# EAGLE design ESP12E Brain (EAGLE 9.3.0)
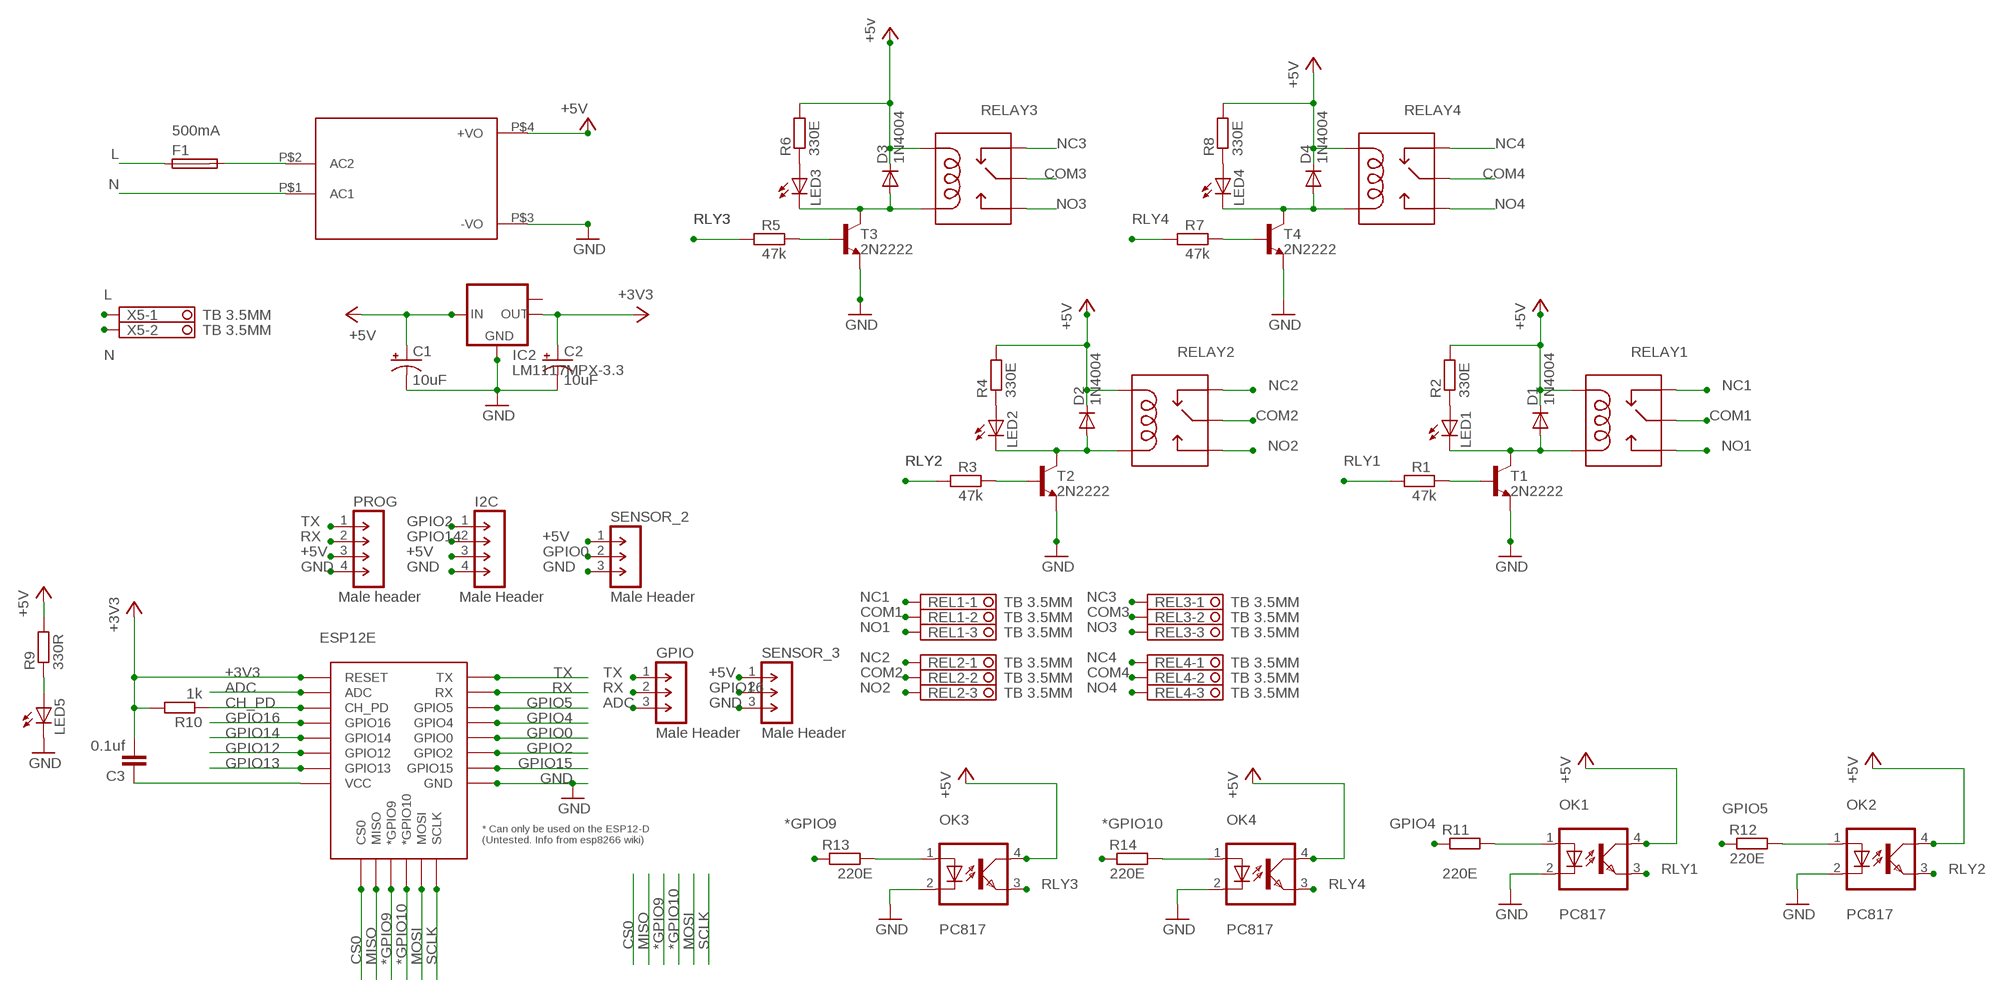
[diagram p0: schematic, sheet 1]

## Parts
C1  10uF  10UF-POLAR-RADIAL-2.5MM-25V-20%  [CPOL-RADIAL-2.5MM-5MM]
C2  10uF  10UF-POLAR-RADIAL-2.5MM-25V-20%  [CPOL-RADIAL-2.5MM-5MM]
C3  0.1uf  C-EU025-030X050  [C025-030X050]
D1  1N4004  [DO41-10]
D2  1N4004  [DO41-10]
D3  1N4004  [DO41-10]
D4  1N4004  [DO41-10]
ESP12E  ESP12ESMD  [ESP12E-SMD]
F1  500mA  FUSEBLANK_5X20MM  [FUSE_HOLDER_5X20MM]
GPIO  Male Header  M-1X03-SIP-100-32  [SIP-100-03-32]
HLK  HLK-PM013W  [HLK-PM01]
I2C  Male Header  M-1X04-SIP-100-32  [SIP-100-04-32]
IC2  LM1117MPX-3.3  [SOT223]
LED1  LEDCHIP-LED0603  [CHIP-LED0603]
LED2  LEDCHIP-LED0603  [CHIP-LED0603]
LED3  LEDCHIP-LED0603  [CHIP-LED0603]
LED4  LEDCHIP-LED0603  [CHIP-LED0603]
LED5  LEDCHIP-LED0603  [CHIP-LED0603]
OK1  PC817  [DIL04]
OK2  PC817  [DIL04]
OK3  PC817  [DIL04]
OK4  PC817  [DIL04]
PROG  Male header  M-1X04-SIP-100-32  [SIP-100-04-32]
R1  47k  R-EU_0204/7  [0204/7]
R2  330E  R-EU_0204/7  [0204/7]
R3  47k  R-EU_0204/7  [0204/7]
R4  330E  R-EU_0204/7  [0204/7]
R5  47k  R-EU_0204/7  [0204/7]
R6  330E  R-EU_0204/7  [0204/7]
R7  47k  R-EU_0204/7  [0204/7]
R8  330E  R-EU_0204/7  [0204/7]
R9  330R  R-EU_0204/7  [0204/7]
R10  1k  R-EU_0204/7  [0204/7]
R11  220E  R-EU_0204/7  [0204/7]
R12  220E  R-EU_0204/7  [0204/7]
R13  220E  R-EU_0204/7  [0204/7]
R14  220E  R-EU_0204/7  [0204/7]
REL1  TB 3.5MM  TERMINAL-BLOCK-3.5MM-3-PIN-ROUND-PAD  [TERMINAL-BLOCK-3-PIN-3.5MM-ROUND-PAD]
REL2  TB 3.5MM  TERMINAL-BLOCK-3.5MM-3-PIN-ROUND-PAD  [TERMINAL-BLOCK-3-PIN-3.5MM-ROUND-PAD]
REL3  TB 3.5MM  TERMINAL-BLOCK-3.5MM-3-PIN-ROUND-PAD  [TERMINAL-BLOCK-3-PIN-3.5MM-ROUND-PAD]
REL4  TB 3.5MM  TERMINAL-BLOCK-3.5MM-3-PIN-ROUND-PAD  [TERMINAL-BLOCK-3-PIN-3.5MM-ROUND-PAD]
RELAY1  SRD-0XVDC-SL-CSRD-05VDC-SL-C  [SRD-0XVDC-SL-C]
RELAY2  SRD-0XVDC-SL-CSRD-05VDC-SL-C  [SRD-0XVDC-SL-C]
RELAY3  SRD-0XVDC-SL-CSRD-05VDC-SL-C  [SRD-0XVDC-SL-C]
RELAY4  SRD-0XVDC-SL-CSRD-05VDC-SL-C  [SRD-0XVDC-SL-C]
SENSOR_2  Male Header  M-1X03-SIP-100-32  [SIP-100-03-32]
SENSOR_3  Male Header  M-1X03-SIP-100-32  [SIP-100-03-32]
T1  2N2222  [TO92-EBC-OVAL]
T2  2N2222  [TO92-EBC-OVAL]
T3  2N2222  [TO92-EBC-OVAL]
T4  2N2222  [TO92-EBC-OVAL]
X5  TB 3.5MM  TERMINAL-BLOCK-3.5MM-2-PIN-ROUND-PAD  [TERMINAL-BLOCK-2-PIN-3.5MM-ROUND-PAD]

## Nets
*GPIO9: ESP12E.GPIO9(*GPIO9) R13.1
*GPIO10: ESP12E.GPIO10(*GPIO10) R14.1
+3V3: C2.1(+) C3.2 ESP12E.RESET IC2.2(OUT) R10.2
+5V: C1.1(+) D1.C D2.C D3.C D4.C HLK.P$4(+VO) I2C.3 IC2.3(IN) OK1.4(COL) OK2.4(COL) OK3.4(COL) OK4.4(COL) PROG.3 R2.2 R4.2 R6.2 R8.2 R9.2 RELAY1.COIL1 RELAY2.COIL1 RELAY3.COIL1 RELAY4.COIL1 SENSOR_2.1 SENSOR_3.1 ; supply symbol labelled +5v
AC2: F1.2 HLK.P$2(AC2)
ADC: ESP12E.ADC GPIO.3
CH_PD: ESP12E.CH_PD R10.1
COM1: REL1.2 RELAY1.SWCOMMON
COM2: REL2.2 RELAY2.SWCOMMON
COM3: REL3.2 RELAY3.SWCOMMON
COM4: REL4.2 RELAY4.SWCOMMON
CS0: ESP12E.CS0
GND: C1.2(-) C2.2(-) ESP12E.GND HLK.P$3(-VO) I2C.4 IC2.1(GND) LED5.C OK1.2(C) OK2.2(C) OK3.2(C) OK4.2(C) PROG.4 SENSOR_2.3 SENSOR_3.3 T1.E T2.E T3.E T4.E
GPIO0: ESP12E.GPIO0 SENSOR_2.2
GPIO2: ESP12E.GPIO2 I2C.1
GPIO4: ESP12E.GPIO4 R11.1
GPIO5: ESP12E.GPIO5 R12.1
GPIO12: ESP12E.GPIO12
GPIO13: ESP12E.GPIO13
GPIO14: ESP12E.GPIO14 I2C.2
GPIO15: ESP12E.GPIO15
GPIO16: ESP12E.GPIO16 SENSOR_3.2
L: F1.1 X5.1
MISO: ESP12E.MISO
MOSI: ESP12E.MOSI
N: HLK.P$1(AC1) X5.2
N$1: R1.2 T1.B
N$2: D1.A LED1.C RELAY1.COIL0 T1.C
N$3: OK1.1(A) R11.2
N$4: D2.A LED2.C RELAY2.COIL0 T2.C
N$6: LED1.A R2.1
N$7: R3.2 T2.B
N$8: LED2.A R4.1
N$9: D3.A LED3.C RELAY3.COIL0 T3.C
N$10: OK2.1(A) R12.2
N$11: R5.2 T3.B
N$12: LED3.A R6.1
N$13: D4.A LED4.C RELAY4.COIL0 T4.C
N$14: OK3.1(A) R13.2
N$15: R7.2 T4.B
N$16: LED4.A R8.1
N$17: C3.1 ESP12E.VCC
N$19: LED5.A R9.1
N$35: OK4.1(A) R14.2
NC1: REL1.1 RELAY1.SWCLOSED(SWCLOSE)
NC2: REL2.1 RELAY2.SWCLOSED(SWCLOSE)
NC3: REL3.1 RELAY3.SWCLOSED(SWCLOSE)
NC4: REL4.1 RELAY4.SWCLOSED(SWCLOSE)
NO1: REL1.3 RELAY1.SWOPEN
NO2: REL2.3 RELAY2.SWOPEN
NO3: REL3.3 RELAY3.SWOPEN
NO4: REL4.3 RELAY4.SWOPEN
RLY1: OK1.3(EMIT) R1.1
RLY2: OK2.3(EMIT) R3.1
RLY3: OK3.3(EMIT) R5.1
RLY4: OK4.3(EMIT) R7.1
RX: ESP12E.RXD0(RX) GPIO.2 PROG.2
SCLK: ESP12E.SCLK
TX: ESP12E.TXD0(TX) GPIO.1 PROG.1
Unconnected: IC2.TAB(OUT1)

## Library data of the parts
C1 C2 = SparkFun-Capacitors:10UF-POLAR: 10.0µF polarized capacitors A capacitor is a passive two-terminal electrical component used to store electrical energy temporarily in an electric field.; PROD_ID: CAP-08440
C3 = rcl:C-EU: CAPACITOR, European symbol; SPICEPREFIX: C
D1-D4 = adafruit:1N4004: DIODE General purpose 1N400x type rectifier (With bigger pads) http://www.ladyada.net/library/pcb/eaglelibrary.html
ESP12E = esp8266modules:ESP12E: ESP12E Module
F1 = fuse:FUSE: Fuse; OC_FARNELL: unknown; OC_NEWARK: unknown
GPIO SENSOR_2 SENSOR_3 = con-headers-jp:M-1X03-: MALE HEADER
HLK = HLK-PM01:HLK-PM01: Hi-Link Power Supply HLK-PM01 3W Author: Ahmed Said <https://github.com/AhmedSaid/EAGLELibraries>
I2C PROG = con-headers-jp:M-1X04-: MALE HEADER
IC2 = lm1117:LM1117MPX-*
LED1-LED5 = adafruit:LED: LED OSRAM: - CHIPLED LG R971, LG N971, LY N971, LG Q971, LY Q971, LO R971, LY R971 LH N974, LH R974 LS Q976, LO Q976, LY Q976 LO Q996 - Hyper CHIPLED LW Q18S LB Q993, LB Q99A, LB R99A - SideLED LS A670, LO A670, LY A670, LG A670, LP A670 LB A673, LV A673, LT A673, LW A673 LH A674 LY A675 LS A676, LA A676, LO A676, LY A676, LW A676 LS A679, LY A679, LG A679 - Hyper Micro SIDELED® LS Y876, LA Y876, LO Y876, LY Y876 LT Y87S - SmartLED LW L88C, LW L88S LB L89C, LB L89S, LG L890 LS L89K, LO L89K, LY L89K LS L896, LA L896, LO L896, LY L896 - TOPLED LS T670, LO T670, LY T670, LG T670, LP T670 LSG T670, LSP T670, LSY T670, LOP T670, LYG T670 LG T671, LOG T671, LSG T671 LB T673, LV T673, LT T673, LW T673 LH T674 LS T676, LA T676, LO T676, LY T676, LB T676, LH T676, LSB T676, LW T676 LB T67C, LV T67C, LT T67C, LS T67K, LO T67K, LY T67K, LW E67C LS E67B, LA E67B, LO E67B, LY E67B, LB E67C, LV E67C, LT E67C LW T67C LS T679, LY T679, LG T679 LS T770, LO T770, LY T770, LG T770, LP T770 LB T773, LV T773, LT T773, LW T773 LH T774 LS E675, LA E675, LY E675, LS T675 LS T776, LA T776, LO T776, LY T776, LB T776 LHGB T686 LT T68C, LB T68C - Hyper Mini TOPLED® LB M676 - Mini TOPLED Santana® LG M470 LS M47K, LO M47K, LY M47K Source: http://www.osram.convergy.de/
OK1-OK4 = optocoupler:PC817: SHARP OPTO COUPLER
R1 R3 R5 R7 = rcl:R-EU_: RESISTOR, European symbol; R1: 4.7k; SPICEPREFIX: 4.7k
R2 R4 R6 R8-R14 = rcl:R-EU_: RESISTOR, European symbol; SPICEPREFIX: R
REL1-REL4 = Rembrandt Electronics - Terminal Block 3-5mm v1-0:TERMINAL-BLOCK-3.5MM-3-PIN: Terminal Block 3.5mm Pitch: 3,5 mm Number of pins: 3 Created by Rembrandt Electronics www.rembrandtelectronics.com
RELAY1-RELAY4 = SRD-0XVDC-SL-C:SRD-0XVDC-SL-C: SRD-05VDC-SL-C SRD-06VDC-SL-C Compatible with: SONGLE Relays SHUN YU JQX-3F other same relays Author: Ahmed Said <https://github.com/AhmedSaid/EAGLELibraries>
T1-T4 = adafruit:2N2222: NPN TRANSISTOR Big oval pads
X5 = Rembrandt Electronics - Terminal Block 3-5mm v1-0:TERMINAL-BLOCK-3.5MM-2-PIN: Terminal Block 3.5mm Pitch: 3,5 mm Number of pins: 2 Created by Rembrandt Electronics www.rembrandtelectronics.com

## Board
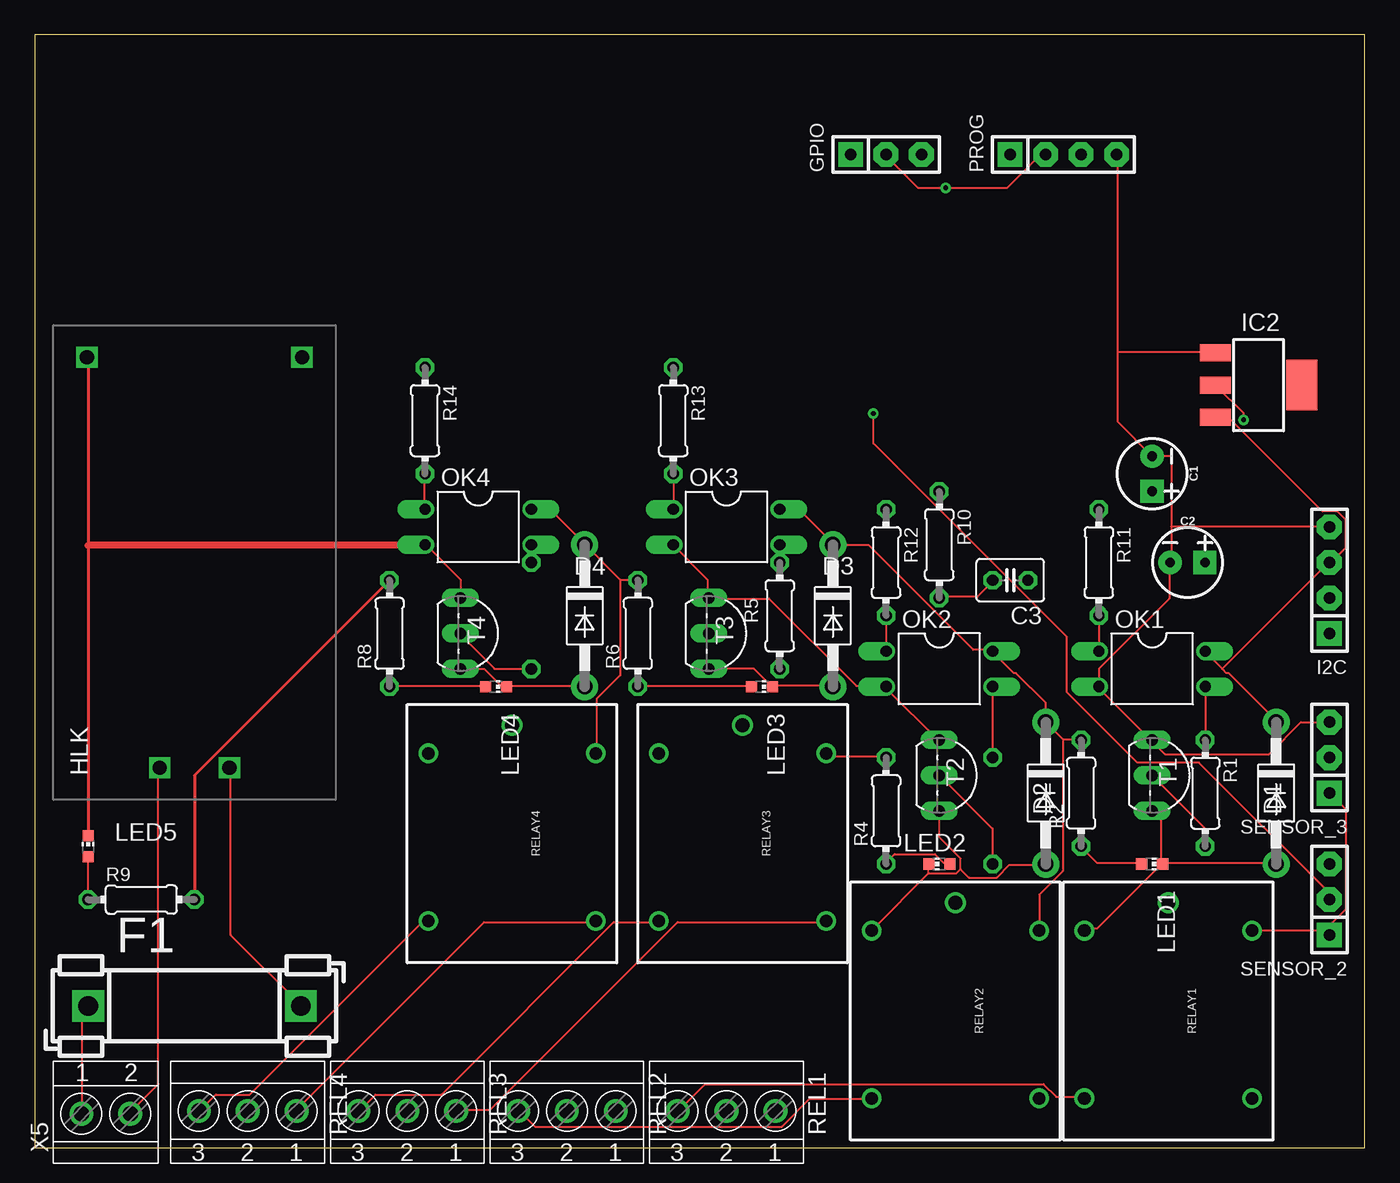
[diagram p1: board, top side]
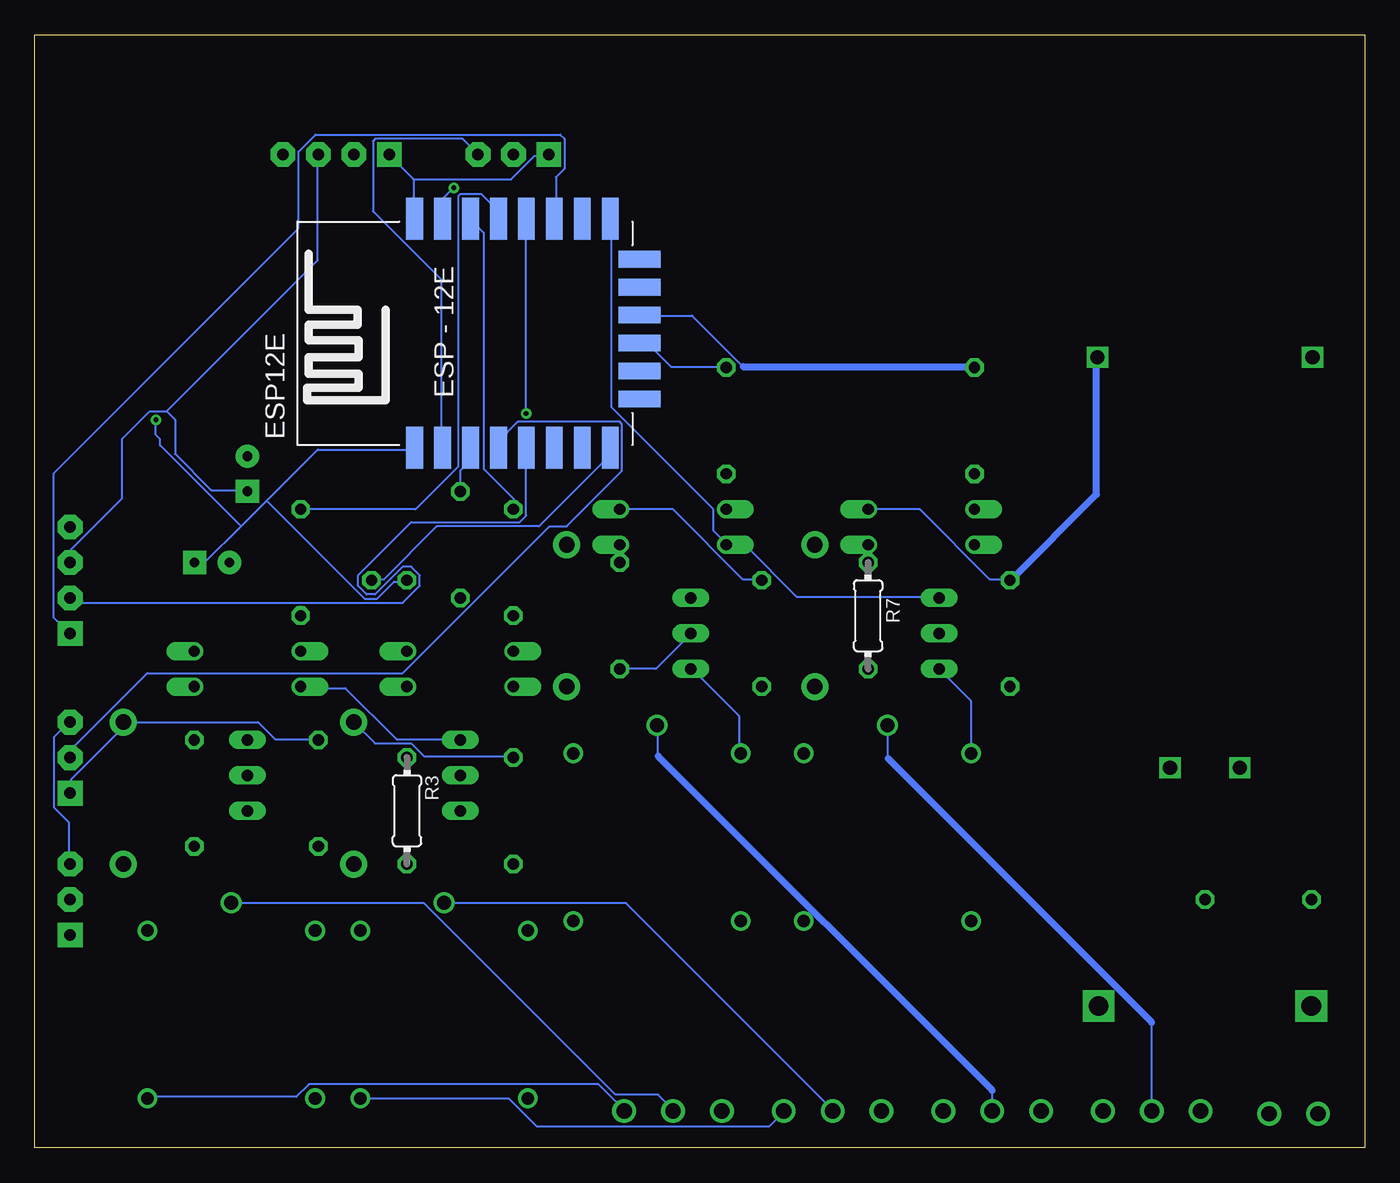
[diagram p2: board, bottom side, seen from below]

Size 95.23 x 79.68 mm. Coordinates in mm from the lower left corner, seen from the top.
Outline: 0,0 95.23,0 95.23,79.68 0,79.68 0,0
Copper layers (1*16): Top 0.035mm / dielectric 1.5mm / Bottom 0.035mm
Design rules "default": minimum track width 6mil, minimum drill 0.35mm, track to track 6mil, track to pad 6mil, pad to pad 6mil, via to via 6mil, smd to smd 6mil, copper to edge 40mil, drill to drill 6mil, minimum pad ring 10mil, minimum via ring 8mil, stop-mask expansion 4mil, vias tented up to drill 0mil, thermal gap 10mil

### Footprints (pad centres in the part's own frame; a part is rotated, then mirrored left to right if it is on the bottom)
CPOL-RADIAL-2.5MM-5MM = drill 0.7 pad 1.651 square: 1 1.25,0 | drill 0.7 pad 1.651: 2 -1.25,0
C025-030X050 = drill 0.813 octagon: 1 -1.27,0; 2 1.27,0
DO41-10 = drill 1.118 pad 1.93: A 5.08,0; C -5.08,0
ESP12E-SMD = smd 3 x 1.2: ADC -8.3,3.8; CH_PD -8.3,1.8; GND 8.1,-8.2; GPIO0 8.1,-2.2; GPIO2 8.1,-4.2; GPIO4 8.1,-0.2; GPIO5 8.1,1.8; GPIO12 -8.3,-4.2; GPIO13 -8.3,-6.2; GPIO14 -8.3,-2.2; GPIO15 8.1,-6.2; GPIO16 -8.3,-0.2; RESET -8.3,5.8; RXD0 8.1,3.8; TXD0 8.1,5.8; VCC -8.3,-8.2 | smd 1.2 x 3: CS0 -4.8,-10.3; GPIO9 -0.8,-10.3; GPIO10 1.2,-10.3; MISO -2.8,-10.3; MOSI 3.2,-10.3; SCLK 5.2,-10.3
FUSE_HOLDER_5X20MM = drill 1.422 pad 2.286 square: 1 0,0; 2 15.24,0
SIP-100-03-32 = drill 0.813 pad 1.778 square: 1 -2.54,0 | drill 0.813 pad 1.778 octagon: 2 0,0; 3 2.54,0
HLK-PM01 = drill 1.016 square: P$1 -14.7,2.5; P$2 -14.7,-2.5; P$3 14.7,7.7; P$4 14.7,-7.7
SIP-100-04-32 = drill 0.813 pad 1.778 square: 1 -3.81,0 | drill 0.813 pad 1.778 octagon: 2 -1.27,0; 3 1.27,0; 4 3.81,0
SOT223 = smd 1.219 x 2.235: 1 -2.311,-3.099; 2 0,-3.099; 3 2.311,-3.099 | smd 3.6 x 2.2: TAB 0,3.099
CHIP-LED0603 = smd 0.8 x 0.8: A 0,-0.75; C 0,0.75
DIL04 = drill 0.813 offset: 1 -1.27,-3.81; 2 1.27,-3.81; 3 1.27,3.81; 4 -1.27,3.81
0204/7 = drill 0.813 octagon: 1 -3.81,0; 2 3.81,0
TERMINAL-BLOCK-3-PIN-3.5MM-ROUND-PAD = drill 1.1 pad 1.7: 1 -3.5,-0.1; 2 0,-0.1; 3 3.5,-0.1
SRD-0XVDC-SL-C = drill 0.9: COIL0 -5.39,-6.12; COIL1 -5.39,5.88; SWCLOSED 6.61,5.88; SWOPEN 6.61,-6.12 | drill 1: SWCOMMON -7.39,-0.12
TO92-EBC-OVAL = drill 0.813 long: B 0,-1.27; C 2.54,-1.27; E -2.54,-1.27
TERMINAL-BLOCK-2-PIN-3.5MM-ROUND-PAD = drill 1.1 pad 1.7: 1 -1.75,-0.1; 2 1.75,-0.1

### Placement (x,y rotation side)
C1  80.01,48.26 270 top
C2  82.55,41.91 0 top
C3  69.85,40.64 180 top
D1  88.9,25.4 270 top
D2  72.39,25.4 270 top
D3  57.15,38.1 270 top
D4  39.37,38.1 270 top
ESP12E  62.23,58.42 90 bottom
F1  3.81,10.16 0 top
GPIO  60.96,71.12 0 top
HLK  11.43,41.91 90 top
I2C  92.71,40.64 90 top
IC2  87.63,54.61 270 top
LED1  80.01,20.32 270 top
LED2  64.77,20.32 90 top
LED3  52.07,33.02 270 top
LED4  33.02,33.02 270 top
LED5  3.81,21.59 0 top
OK1  80.01,34.29 270 top
OK2  64.77,34.29 270 top
OK3  49.53,44.45 270 top
OK4  31.75,44.45 270 top
PROG  73.66,71.12 0 top
R1  83.82,25.4 270 top
R2  74.93,25.4 90 top
R3  68.58,24.13 270 bottom
R4  60.96,24.13 90 top
R5  53.34,38.1 270 top
R6  43.18,36.83 90 top
R7  35.56,38.1 270 bottom
R8  25.4,36.83 90 top
R9  7.62,17.78 0 top
R10  64.77,43.18 270 top
R11  76.2,41.91 270 top
R12  60.96,41.91 270 top
R13  45.72,52.07 270 top
R14  27.94,52.07 270 top
REL1  49.53,2.54 180 top
REL2  38.1,2.54 180 top
REL3  26.67,2.54 180 top
REL4  15.24,2.54 180 top
RELAY1  81.28,10.16 270 top
RELAY2  66.04,10.16 270 top
RELAY3  50.8,22.86 270 top
RELAY4  34.29,22.86 270 top
SENSOR_2  92.71,17.78 90 top
SENSOR_3  92.71,27.94 90 top
T1  81.28,26.67 270 top
T2  66.04,26.67 270 top
T3  49.53,36.83 270 top
T4  31.75,36.83 270 top
X5  5.08,2.54 0 top

### Tracks (layer width: path | path; a pad name or v marks a point on that pad's centre or on a via)
*GPIO9
  Bottom 0.152: R13.1 45.72,55.93 49.68,55.93 51.36,57.61 51.82,57.61 ESP12E.GPIO9
*GPIO10
  Bottom 0.152: 44.5,55.93 48.16,59.59 51.82,59.59 ESP12E.GPIO10 | 28.04,55.93 R14.1
  Bottom 0.508: 44.5,55.93 28.04,55.93
+3V3  (via drill 0.35)
  Top 0.152: R10.2 64.77,39.47 67.51,39.47 68.58,40.54 C3.2 | v86.56,52.12 86.56,52.58 84.58,54.56 IC2.2
  Bottom 0.152: 80.47,44.5 83.06,41.91 C2.1 | 80.47,44.5 78.64,46.33 | 78.64,46.33 74.98,49.99 68.12,49.99 ESP12E.RESET | 80.47,44.5 86.26,50.29 86.26,50.75 86.56,51.05 v86.56,52.12 | 78.64,46.33 71.63,39.32 70.71,39.32 69.49,40.54 68.58,40.54 C3.2
+5V
  Top 0.152: OK3.4 54.71,45.72 57.15,43.28 D3.C 57.15,43.13 59.74,43.13 67.21,35.66 68.58,35.66 OK2.4 68.58,35.51 70.1,33.98 70.26,33.98 72.39,31.85 D2.C 73.61,29.26 | OK4.4 36.88,45.72 39.32,43.28 D4.C 39.47,43.13 41.91,40.69 | 41.91,40.69 43.13,40.69 R6.2 | 41.91,40.69 41.91,33.83 40.23,32.16 40.23,28.35 RELAY4.COIL1 | R4.2 60.96,28.04 56.84,28.04 56.69,28.19 RELAY3.COIL1 | 73.61,29.26 74.83,29.26 R2.2 | 73.61,29.26 73.61,19.81 71.93,18.14 71.93,15.7 RELAY2.COIL1 | 92.35,15.54 87.17,15.54 RELAY1.COIL1 | 92.35,15.54 92.66,15.24 SENSOR_2.1 92.35,15.54 | 85.04,34.29 85.34,33.98 85.5,33.98 89,30.48 D1.C | 85.04,34.29 83.82,35.51 OK1.4 | 92.35,15.54 93.88,17.07 93.88,24.23 SENSOR_3.1 | 85.04,34.29 92.66,41.91 I2C.3 92.81,41.91 93.88,42.98 93.88,44.96 93.27,45.57 92.2,45.57 85.5,52.27 84.58,52.27 IC2.3
  Top 0.203: R9.2 11.43,26.67 R8.2
  Bottom 0.152: OK3.4 49.53,45.72 44.5,40.69 43.28,40.69 R6.2 | 19.2,56.54 HLK.P$4 | 25.3,40.69 R8.2 25.45,40.69 26.82,40.69 31.85,45.72 OK4.4 | D2.C 70.87,28.96 68.28,28.96 67.36,28.04 60.96,28.04 R4.2 | SENSOR_3.1 92.66,25.45 92.66,26.36 89,30.02 89,30.48 D1.C 79.25,30.48 78.03,29.26 74.98,29.26 R2.2 | 85.8,52.73 85.19,52.12 85.19,49.68 82.6,47.09 80.01,47.09 C1.1 | 85.8,52.73 87.02,52.73 89,50.75 89,46.48 92.66,42.82 92.66,41.91 I2C.3 | 85.8,52.73 74.98,63.55 74.98,71.02 PROG.3
  Bottom 0.508: 19.2,56.54 19.2,46.79 25.3,40.69
AC2
  Top 0.152: HLK.P$2 14.02,27.13 14.02,15.24 19.05,10.21 F1.2
ADC
  Bottom 0.152: GPIO.3 64.62,72.24 70.87,72.24 71.02,72.08 71.02,67.06 66.14,62.18 66.14,50.14 ESP12E.ADC
CH_PD
  Bottom 0.152: R10.1 64.77,48.46 64.16,49.07 64.16,49.99 ESP12E.CH_PD
COM1
  Bottom 0.152: RELAY1.SWCOMMON 81.08,17.53 67.36,17.53 53.65,3.81 50.6,3.81 49.53,2.74 REL1.2
COM2
  Bottom 0.152: RELAY2.SWCOMMON 65.84,17.53 52.88,17.53 38.1,2.74 REL2.2
COM3
  Bottom 0.152: 50.6,28.04 50.6,30.18 RELAY3.SWCOMMON | REL3.2 26.67,4.12
  Bottom 0.508: 26.67,4.12 50.6,28.04
COM4
  Bottom 0.152: 34.14,27.89 34.14,30.18 RELAY4.SWCOMMON | REL4.2 15.24,8.99
  Bottom 0.508: 15.24,8.99 34.14,27.89
GND
  Top 0.152: T2.E 64.77,29.11 60.96,32.92 OK2.2 60.96,33.07 58.83,33.07 52.58,39.32 48.31,39.32 T3.E 48.16,39.47 48.16,40.69 45.72,43.13 OK3.2 | 80.01,29.11 76.2,32.92 OK1.2 76.2,34.29 81.23,39.32 81.23,41.91 C2.2 81.38,41.91 81.38,44.5 | SENSOR_3.3 90.68,30.48 88.39,28.19 80.92,28.19 80.01,29.11 | 80.01,29.11 T1.E | 80.01,49.53 81.38,49.53 81.38,44.5 | 81.38,44.5 92.66,44.5 I2C.4 | 77.57,57 77.57,51.97 80.01,49.53 | 77.57,57 77.57,71.02 PROG.4 | 80.01,49.53 C1.2 | 3.81,56.54 HLK.P$3 | T4.E 30.48,40.69 28.04,43.13 OK4.2 27.89,43.13 | 77.57,57 84.43,57 IC2.1
  Top 0.203: 3.81,56.54 3.81,43.13 LED5.C
  Top 0.508: 27.89,43.13 3.81,43.13
  Bottom 0.152: SENSOR_2.3 92.81,20.42 92.81,23.32 93.88,24.38 93.88,29.41 92.81,30.48 SENSOR_3.3 | T2.E 64.77,29.26 69.34,29.26 73,32.92 76.2,32.92 OK1.2 | ESP12E.GND 53.95,66.45 53.95,53.03 46.63,45.72 46.63,44.2 45.72,43.28 OK3.2 45.72,43.13 44.35,43.13 40.69,39.47 30.48,39.47 T4.E
GPIO0  (via drill 0.35)
  Top 0.152: v60.05,52.58 60.05,50.44 73.91,36.58 73.91,32.61 78.94,27.58 83.36,27.58 92.66,18.29 92.66,17.83 SENSOR_2.2
  Bottom 0.152: v60.05,52.58 60.05,66.45 ESP12E.GPIO0
GPIO2
  Bottom 0.152: ESP12E.GPIO2 57.91,66.6 57.91,69.49 57.3,70.1 57.3,72.24 57.61,72.54 75.13,72.54 76.35,71.32 76.35,65.84 93.88,48.31 93.88,37.95 92.81,36.88 I2C.1
GPIO4
  Bottom 0.152: R11.1 67.97,45.72 64.92,48.77 64.92,68.12 64.77,68.28 63.25,68.28 62.18,67.21 62.18,66.6 ESP12E.GPIO4
GPIO5
  Bottom 0.152: R12.1 60.96,46.48 63.09,48.62 63.09,65.53 64.01,66.45 ESP12E.GPIO5
GPIO14
  Bottom 0.152: I2C.2 92.35,39.01 68.89,39.01 67.67,40.23 67.67,41 68.28,41.6 68.89,41.6 70.87,39.62 71.48,39.62 72.08,40.23 72.08,41 68.28,44.81 60.5,44.81 60.05,45.26 60.05,49.99 ESP12E.GPIO14
GPIO16
  Bottom 0.152: ESP12E.GPIO16 62.03,50.14 62.03,50.6 60.66,51.97 53.34,51.97 53.19,51.82 53.19,48.46 57.15,44.5 58.37,44.5 68.89,33.98 87.17,33.98 92.66,28.5 92.66,28.04 SENSOR_3.2
L
  Top 0.152: X5.1 3.35,2.59 3.35,9.6 3.81,10.06 F1.1
N
  Top 0.152: HLK.P$1 8.84,27.13 8.84,4.57 6.86,2.59 X5.2
N$1
  Top 0.152: R1.2 83.82,22.86 T1.B
N$2
  Top 0.152: LED1.C 80.62,20.42 80.62,23.47 80.01,24.08 T1.C | RELAY1.COIL0 75.29,15.7 76.05,15.7 80.62,20.27 LED1.C | D1.A 88.85,20.42 80.77,20.42 LED1.C
N$3
  Top 0.152: R11.2 OK1.1
N$4
  Top 0.152: 64.01,19.66 64.01,20.27 LED2.C | 64.01,19.66 60.05,15.7 RELAY2.COIL0 | T2.C 64.77,22.25 66.29,20.73 66.29,19.96 | 66.29,19.96 65.99,19.66 64.01,19.66 | 66.29,19.96 66.9,19.36 68.89,19.36 69.8,20.27 72.39,20.27 D2.A
N$6
  Top 0.152: LED1.A 79.25,20.42 76.05,20.42 74.98,21.49 R2.1
N$7
  Top 0.152: R3.2 68.58,22.86 T2.B
N$8
  Top 0.152: LED2.A 65.38,20.42 65.08,20.42 64.47,21.03 61.57,21.03 60.96,20.42 R4.1
N$9
  Top 0.152: D3.A 57.15,33.07 52.88,33.07 LED3.C 52.73,33.07 51.51,34.29 T3.C
  Bottom 0.152: RELAY3.COIL0 44.81,28.35 44.81,30.94 48.16,34.29 T3.C
N$10
  Top 0.152: R12.2 OK2.1
N$11
  Bottom 0.152: R5.2 50.75,34.29 48.31,36.73 T3.B
N$12
  Top 0.152: LED3.A 51.21,33.07 43.28,33.07 R6.1
N$13
  Top 0.152: T4.C 32.16,34.29 33.38,33.07 33.68,33.07 LED4.C 33.83,33.07 39.32,33.07 D4.A
  Bottom 0.152: T4.C 28.19,32 28.19,28.35 RELAY4.COIL0
N$14
  Top 0.152: R13.2 OK3.1
N$15
  Top 0.152: R7.2 32.92,34.29 30.48,36.73 T4.B
N$16
  Top 0.152: LED4.A 32.16,33.07 25.45,33.07 R8.1
N$17
  Bottom 0.152: C3.1 71.02,40.69 70.26,40.69 66.45,44.5 59.13,44.5 54.1,49.53 54.1,49.99 ESP12E.VCC
N$19
  Top 0.152: R9.1 LED5.A
N$35
  Top 0.152: OK4.1 27.89,45.72 27.89,48.16 R14.2
NC1
  Bottom 0.152: RELAY1.SWCLOSED 87.02,3.66 76.5,3.66 75.59,4.57 54.86,4.57 53.03,2.74 REL1.1
NC2
  Bottom 0.152: RELAY2.SWCLOSED 71.78,3.5 61.27,3.5 59.28,1.52 42.67,1.52 41.6,2.59 REL2.1
NC3
  Top 0.152: RELAY3.SWCLOSED 56.54,16.15 46.02,16.15 32.61,2.74 30.18,2.74 REL3.1
NC4
  Top 0.152: RELAY4.SWCLOSED 40.08,16.15 32.16,16.15 18.75,2.74 REL4.1
NO1
  Top 0.152: RELAY1.SWOPEN 75.13,3.66 73.15,3.66 72.24,4.57 48.01,4.57 46.18,2.74 REL1.3
NO2
  Top 0.152: RELAY2.SWOPEN 59.89,3.5 55.47,3.5 53.49,1.52 35.81,1.52 34.75,2.59 REL2.3
NO3
  Top 0.152: RELAY3.SWOPEN 44.65,16.15 41.45,16.15 29.11,3.81 24.38,3.81 23.32,2.74 REL3.3
NO4
  Top 0.152: RELAY4.SWOPEN 28.04,16.15 27.74,16.15 15.39,3.81 12.95,3.81 11.89,2.74 REL4.3
RLY1
  Top 0.152: OK1.3 R1.1
RLY2
  Top 0.152: OK2.3 R3.1
RLY3
  Top 0.152: OK3.3 R5.1
RLY4
  Top 0.152: R7.1 35.66,41.91 35.66,43.13 OK4.3
RX  (via drill 0.35)
  Top 0.152: GPIO.2 60.96,71.02 63.25,68.73 v65.23,68.73 69.65,68.73 71.93,71.02 72.39,71.02 PROG.2
  Bottom 0.152: v65.23,68.73 65.99,67.97 65.99,66.6 ESP12E.RXD0
TX
  Bottom 0.152: 68.12,69.34 68.12,66.6 ESP12E.TXD0 | 68.12,69.34 69.8,71.02 PROG.1 | 68.12,69.34 61.11,69.34 59.44,71.02 58.52,71.02 GPIO.1